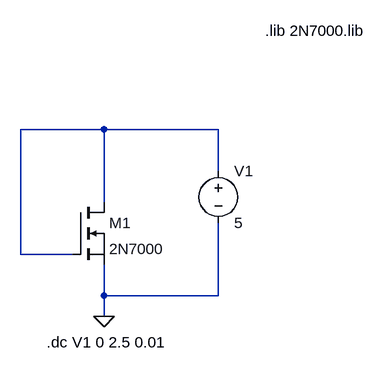
[diagram p0: schematic 2N7000.asc]
2N7000.asc, the LTspice schematic file:
Version 4
SHEET 1 880 680
WIRE 208 16 80 16
WIRE 384 16 208 16
WIRE 384 80 384 16
WIRE 208 128 208 16
WIRE 80 208 80 16
WIRE 160 208 80 208
WIRE 208 272 208 224
WIRE 384 272 384 160
WIRE 384 272 208 272
WIRE 208 304 208 272
FLAG 208 304 0
SYMBOL nmos 160 128 R0
SYMATTR InstName M1
SYMATTR Value 2N7000
SYMATTR Prefix X
SYMBOL voltage 384 64 R0
WINDOW 123 0 0 Left 0
WINDOW 39 0 0 Left 0
SYMATTR InstName V1
SYMATTR Value 5
TEXT 456 -136 Left 2 !.lib 2N7000.lib
TEXT 120 344 Left 2 !.dc V1 0 2.5 0.01

The netlist it stands for:
* 2N7000.asc
XM1 N001 N001 0 2N7000  ; pins D G S
V1 N001 0 5
.lib 2N7000.lib
.dc V1 0 2.5 0.01
.backanno
.end